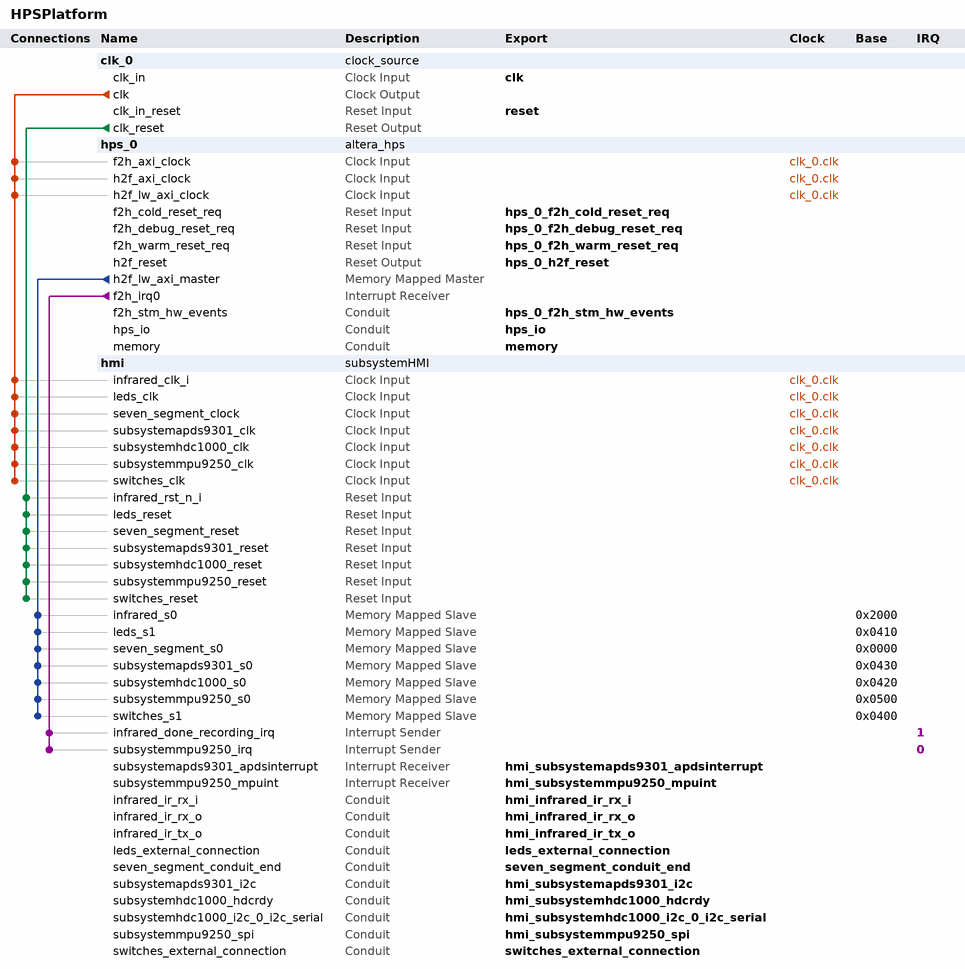
[diagram p0: system contents]
# Platform Designer (Qsys) system HPSPlatform, Cyclone V 5CSEMA5F31C6
# Parameters at their usual value, and those the tool derives, are not listed.
package require -exact qsys 19.1
create_system HPSPlatform
set_project_property DEVICE_FAMILY {Cyclone V}
set_project_property DEVICE 5CSEMA5F31C6

add_instance clk_0 clock_source 19.1
set_instance_parameter_value clk_0 clockFrequency 50000000

add_instance hps_0 altera_hps 19.1
set_instance_parameter_value hps_0 EMAC1_Mode RGMII
set_instance_parameter_value hps_0 EMAC1_PinMuxing {HPS I/O Set 0}
set_instance_parameter_value hps_0 F2SCLK_COLDRST_Enable true
set_instance_parameter_value hps_0 F2SCLK_DBGRST_Enable true
set_instance_parameter_value hps_0 F2SCLK_WARMRST_Enable true
set_instance_parameter_value hps_0 F2SINTERRUPT_Enable true
set_instance_parameter_value hps_0 F2S_Width 1
set_instance_parameter_value hps_0 FPGA_PERIPHERAL_OUTPUT_CLOCK_FREQ_EMAC0_GTX_CLK 125
set_instance_parameter_value hps_0 FPGA_PERIPHERAL_OUTPUT_CLOCK_FREQ_EMAC0_MD_CLK 2.5
set_instance_parameter_value hps_0 FPGA_PERIPHERAL_OUTPUT_CLOCK_FREQ_EMAC1_GTX_CLK 125
set_instance_parameter_value hps_0 FPGA_PERIPHERAL_OUTPUT_CLOCK_FREQ_EMAC1_MD_CLK 2.5
set_instance_parameter_value hps_0 HPS_PROTOCOL DDR3
set_instance_parameter_value hps_0 I2C0_Mode I2C
set_instance_parameter_value hps_0 I2C0_PinMuxing {HPS I/O Set 0}
set_instance_parameter_value hps_0 I2C1_Mode I2C
set_instance_parameter_value hps_0 I2C1_PinMuxing {HPS I/O Set 1}
set_instance_parameter_value hps_0 LWH2F_Enable true
set_instance_parameter_value hps_0 MEM_BANKADDR_WIDTH 3
set_instance_parameter_value hps_0 MEM_CLK_FREQ 400.0
set_instance_parameter_value hps_0 MEM_COL_ADDR_WIDTH 10
set_instance_parameter_value hps_0 MEM_DQ_WIDTH 32
set_instance_parameter_value hps_0 MEM_DRV_STR RZQ/6
set_instance_parameter_value hps_0 MEM_ROW_ADDR_WIDTH 15
set_instance_parameter_value hps_0 MEM_RTT_NOM RZQ/6
set_instance_parameter_value hps_0 MEM_RTT_WR {Dynamic ODT off}
set_instance_parameter_value hps_0 MEM_TCL 7
set_instance_parameter_value hps_0 MEM_TFAW_NS 45.0
set_instance_parameter_value hps_0 MEM_TRAS_NS 36.0
set_instance_parameter_value hps_0 MEM_TRCD_NS 13.125
set_instance_parameter_value hps_0 MEM_TRFC_NS 300.0
set_instance_parameter_value hps_0 MEM_TRP_NS 13.125
set_instance_parameter_value hps_0 MEM_VENDOR Micron
set_instance_parameter_value hps_0 MEM_WTCL 7
set_instance_parameter_value hps_0 QSPI_Mode N/A
set_instance_parameter_value hps_0 QSPI_PinMuxing Unused
set_instance_parameter_value hps_0 REF_CLK_FREQ 25.0
set_instance_parameter_value hps_0 S2FCLK_USER2CLK 5
set_instance_parameter_value hps_0 S2F_Width 1
set_instance_parameter_value hps_0 SDIO_Mode {4-bit Data}
set_instance_parameter_value hps_0 SDIO_PinMuxing {HPS I/O Set 0}
set_instance_parameter_value hps_0 SPIM1_Mode {Single Slave Select}
set_instance_parameter_value hps_0 SPIM1_PinMuxing {HPS I/O Set 0}
set_instance_parameter_value hps_0 STM_Enable true
set_instance_parameter_value hps_0 TIMING_BOARD_AC_SKEW 0.02
set_instance_parameter_value hps_0 TIMING_BOARD_AC_TO_CK_SKEW 0.01
set_instance_parameter_value hps_0 TIMING_BOARD_DQ_TO_DQS_SKEW 0.05
set_instance_parameter_value hps_0 TIMING_BOARD_MAX_CK_DELAY 0.03
set_instance_parameter_value hps_0 TIMING_BOARD_MAX_DQS_DELAY 0.02
set_instance_parameter_value hps_0 TIMING_BOARD_SKEW_BETWEEN_DQS 0.06
set_instance_parameter_value hps_0 TIMING_BOARD_SKEW_CKDQS_DIMM_MAX 0.12
set_instance_parameter_value hps_0 TIMING_BOARD_SKEW_CKDQS_DIMM_MIN 0.06
set_instance_parameter_value hps_0 TIMING_BOARD_SKEW_WITHIN_DQS 0.01
set_instance_parameter_value hps_0 TIMING_TDH 65
set_instance_parameter_value hps_0 TIMING_TDQSCK 255
set_instance_parameter_value hps_0 TIMING_TDQSQ 125
set_instance_parameter_value hps_0 TIMING_TDS 30
set_instance_parameter_value hps_0 TIMING_TIH 140
set_instance_parameter_value hps_0 TIMING_TIS 190
set_instance_parameter_value hps_0 TIMING_TQSH 0.4
set_instance_parameter_value hps_0 UART0_Mode {No Flow Control}
set_instance_parameter_value hps_0 UART0_PinMuxing {HPS I/O Set 0}
set_instance_parameter_value hps_0 USB1_Mode SDR
set_instance_parameter_value hps_0 USB1_PinMuxing {HPS I/O Set 0}
set_instance_parameter_value hps_0 desired_cfg_clk_mhz 100.0
set_instance_parameter_value hps_0 desired_qspi_clk_mhz 400.0

add_instance hmi subsystemHMI 1.0

# connections
add_connection clk_0.clk hmi.infrared_clk_i clock
add_connection clk_0.clk hmi.leds_clk clock
add_connection clk_0.clk hmi.seven_segment_clock clock
add_connection clk_0.clk hmi.subsystemapds9301_clk clock
add_connection clk_0.clk hmi.subsystemhdc1000_clk clock
add_connection clk_0.clk hmi.subsystemmpu9250_clk clock
add_connection clk_0.clk hmi.switches_clk clock
add_connection clk_0.clk hps_0.f2h_axi_clock clock
add_connection clk_0.clk hps_0.h2f_axi_clock clock
add_connection clk_0.clk hps_0.h2f_lw_axi_clock clock
add_connection clk_0.clk_reset hmi.infrared_rst_n_i reset
add_connection clk_0.clk_reset hmi.leds_reset reset
add_connection clk_0.clk_reset hmi.seven_segment_reset reset
add_connection clk_0.clk_reset hmi.subsystemapds9301_reset reset
add_connection clk_0.clk_reset hmi.subsystemhdc1000_reset reset
add_connection clk_0.clk_reset hmi.subsystemmpu9250_reset reset
add_connection clk_0.clk_reset hmi.switches_reset reset
add_connection hps_0.h2f_lw_axi_master hmi.infrared_s0 avalon
set_connection_parameter_value hps_0.h2f_lw_axi_master/hmi.infrared_s0 baseAddress 0x2000
add_connection hps_0.h2f_lw_axi_master hmi.leds_s1 avalon
set_connection_parameter_value hps_0.h2f_lw_axi_master/hmi.leds_s1 baseAddress 0x0410
add_connection hps_0.h2f_lw_axi_master hmi.seven_segment_s0 avalon
set_connection_parameter_value hps_0.h2f_lw_axi_master/hmi.seven_segment_s0 baseAddress 0x0000
add_connection hps_0.h2f_lw_axi_master hmi.subsystemapds9301_s0 avalon
set_connection_parameter_value hps_0.h2f_lw_axi_master/hmi.subsystemapds9301_s0 baseAddress 0x0430
add_connection hps_0.h2f_lw_axi_master hmi.subsystemhdc1000_s0 avalon
set_connection_parameter_value hps_0.h2f_lw_axi_master/hmi.subsystemhdc1000_s0 baseAddress 0x0420
add_connection hps_0.h2f_lw_axi_master hmi.subsystemmpu9250_s0 avalon
set_connection_parameter_value hps_0.h2f_lw_axi_master/hmi.subsystemmpu9250_s0 baseAddress 0x0500
add_connection hps_0.h2f_lw_axi_master hmi.switches_s1 avalon
set_connection_parameter_value hps_0.h2f_lw_axi_master/hmi.switches_s1 baseAddress 0x0400
add_connection hps_0.f2h_irq0 hmi.infrared_done_recording_irq interrupt
set_connection_parameter_value hps_0.f2h_irq0/hmi.infrared_done_recording_irq irqNumber 1
add_connection hps_0.f2h_irq0 hmi.subsystemmpu9250_irq interrupt
set_connection_parameter_value hps_0.f2h_irq0/hmi.subsystemmpu9250_irq irqNumber 0

# exported interfaces
add_interface clk clock sink
set_interface_property clk EXPORT_OF clk_0.clk_in
add_interface hmi_infrared_ir_rx_i conduit end
set_interface_property hmi_infrared_ir_rx_i EXPORT_OF hmi.infrared_ir_rx_i
add_interface hmi_infrared_ir_rx_o conduit end
set_interface_property hmi_infrared_ir_rx_o EXPORT_OF hmi.infrared_ir_rx_o
add_interface hmi_infrared_ir_tx_o conduit end
set_interface_property hmi_infrared_ir_tx_o EXPORT_OF hmi.infrared_ir_tx_o
add_interface hmi_subsystemapds9301_apdsinterrupt interrupt receiver
set_interface_property hmi_subsystemapds9301_apdsinterrupt EXPORT_OF hmi.subsystemapds9301_apdsinterrupt
add_interface hmi_subsystemapds9301_i2c conduit end
set_interface_property hmi_subsystemapds9301_i2c EXPORT_OF hmi.subsystemapds9301_i2c
add_interface hmi_subsystemhdc1000_hdcrdy conduit end
set_interface_property hmi_subsystemhdc1000_hdcrdy EXPORT_OF hmi.subsystemhdc1000_hdcrdy
add_interface hmi_subsystemhdc1000_i2c_0_i2c_serial conduit end
set_interface_property hmi_subsystemhdc1000_i2c_0_i2c_serial EXPORT_OF hmi.subsystemhdc1000_i2c_0_i2c_serial
add_interface hmi_subsystemmpu9250_mpuint interrupt receiver
set_interface_property hmi_subsystemmpu9250_mpuint EXPORT_OF hmi.subsystemmpu9250_mpuint
add_interface hmi_subsystemmpu9250_spi conduit end
set_interface_property hmi_subsystemmpu9250_spi EXPORT_OF hmi.subsystemmpu9250_spi
add_interface hps_0_f2h_cold_reset_req reset sink
set_interface_property hps_0_f2h_cold_reset_req EXPORT_OF hps_0.f2h_cold_reset_req
add_interface hps_0_f2h_debug_reset_req reset sink
set_interface_property hps_0_f2h_debug_reset_req EXPORT_OF hps_0.f2h_debug_reset_req
add_interface hps_0_f2h_stm_hw_events conduit end
set_interface_property hps_0_f2h_stm_hw_events EXPORT_OF hps_0.f2h_stm_hw_events
add_interface hps_0_f2h_warm_reset_req reset sink
set_interface_property hps_0_f2h_warm_reset_req EXPORT_OF hps_0.f2h_warm_reset_req
add_interface hps_0_h2f_reset reset source
set_interface_property hps_0_h2f_reset EXPORT_OF hps_0.h2f_reset
add_interface hps_io conduit end
set_interface_property hps_io EXPORT_OF hps_0.hps_io
add_interface leds_external_connection conduit end
set_interface_property leds_external_connection EXPORT_OF hmi.leds_external_connection
add_interface memory conduit end
set_interface_property memory EXPORT_OF hps_0.memory
add_interface reset reset sink
set_interface_property reset EXPORT_OF clk_0.clk_in_reset
add_interface seven_segment_conduit_end conduit end
set_interface_property seven_segment_conduit_end EXPORT_OF hmi.seven_segment_conduit_end
add_interface switches_external_connection conduit end
set_interface_property switches_external_connection EXPORT_OF hmi.switches_external_connection

set_interconnect_requirement {$system} qsys_mm.clockCrossingAdapter HANDSHAKE
set_interconnect_requirement {$system} qsys_mm.enableEccProtection FALSE
set_interconnect_requirement {$system} qsys_mm.insertDefaultSlave FALSE
set_interconnect_requirement {$system} qsys_mm.maxAdditionalLatency 1

save_system HPSPlatform.qsys
